# Altium schematic sheet CSP_without_inFET.SchDoc
size A4; DocumentNumber: 2; SheetNumber: 2; SheetTotal: 4
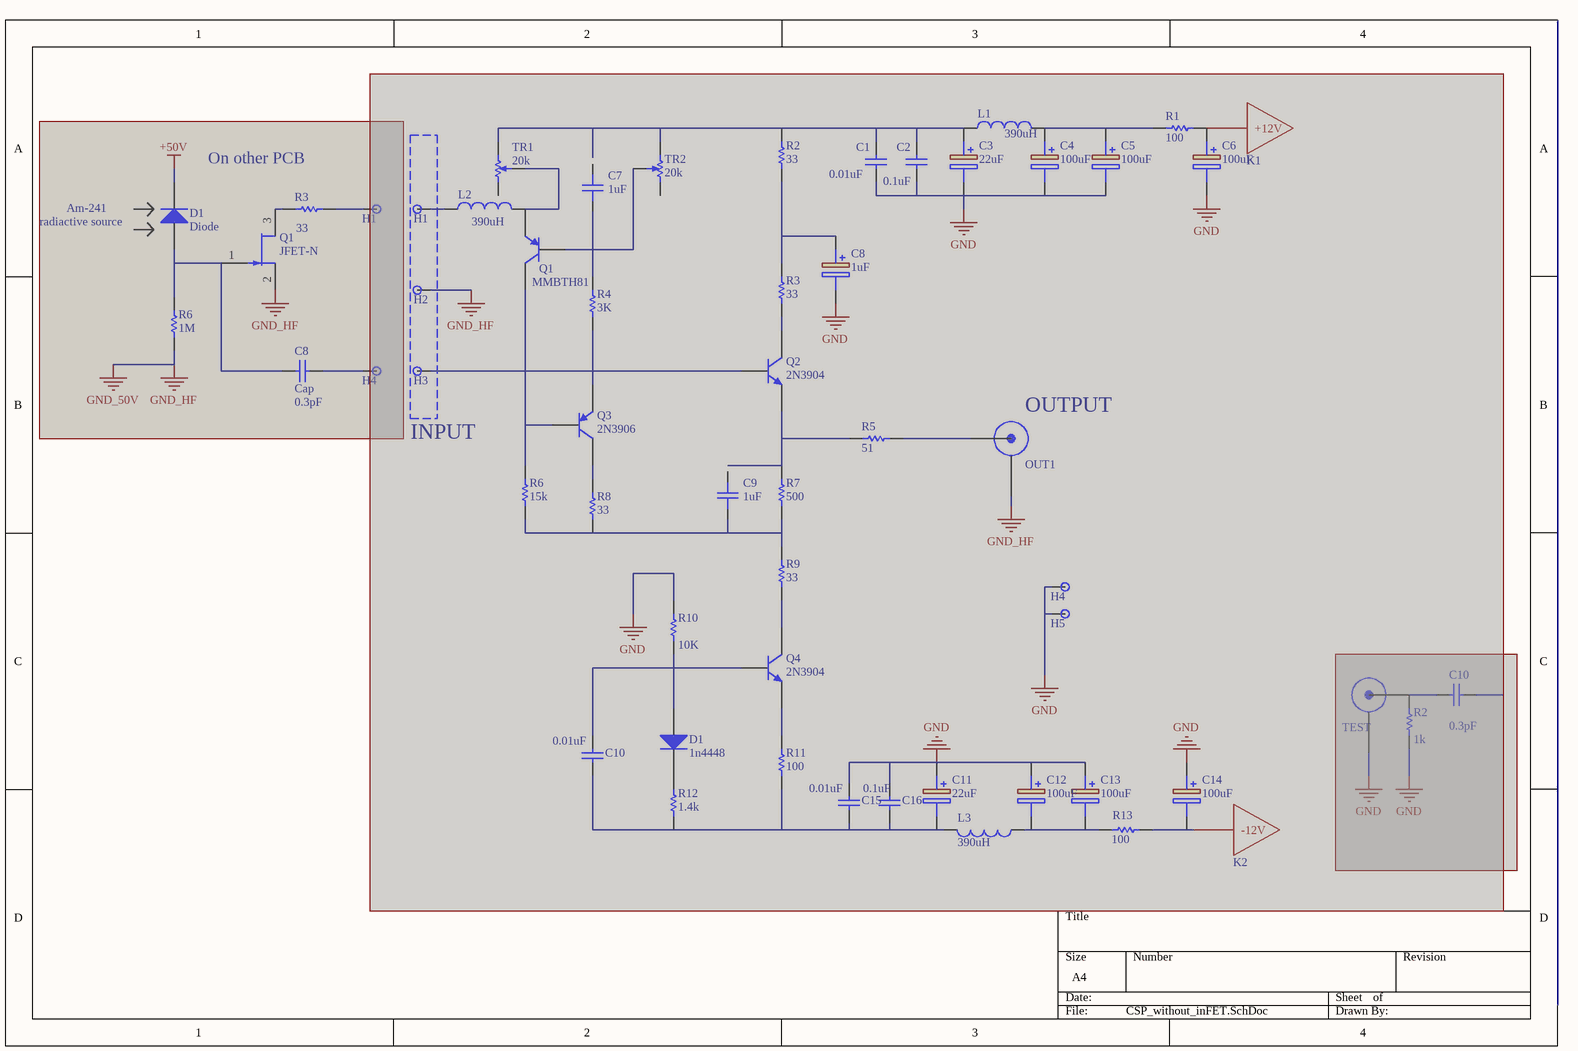
[diagram p0: CSP_without_inFET.SchDoc]

## Parts
(Parts that share a designator on the sheet are numbered #1, #2 ... from top to bottom, then left to right.)
C1  0.01uF  [SMD-0805-C]  (masked out: inside a compile mask, not in the netlist)
C2  0.1uF  [SMD-0805-C]  (masked out: inside a compile mask, not in the netlist)
C3  22uF  [CAPAE660X550N]  (masked out: inside a compile mask, not in the netlist)
C4  100uF  [CAPAE660X800N]  (masked out: inside a compile mask, not in the netlist)
C5  100uF  [CAPAE660X800N]  (masked out: inside a compile mask, not in the netlist)
C6  100uF  [CAPAE660X800N]  (masked out: inside a compile mask, not in the netlist)
C7  1uF  [CAPC3225X15L]  (masked out: inside a compile mask, not in the netlist)
C8#1  1uF  [CAPAE430X550N]  (masked out: inside a compile mask, not in the netlist)
C8#2  Cap  value 0.3pF  [0603]  (masked out: inside a compile mask, not in the netlist)
C9  1uF  [CAPC3225X15L]  (masked out: inside a compile mask, not in the netlist)
C10#1  value 0.3pF  [0603]  (hidden comment: Cap)  (masked out: inside a compile mask, not in the netlist)
C10#2  0.01uF  [SMD-0805-C]  (masked out: inside a compile mask, not in the netlist)
C11  22uF  [CAPAE660X550N]  (masked out: inside a compile mask, not in the netlist)
C12  100uF  [CAPAE660X800N]  (masked out: inside a compile mask, not in the netlist)
C13  100uF  [CAPAE660X800N]  (masked out: inside a compile mask, not in the netlist)
C14  100uF  [CAPAE660X800N]  (masked out: inside a compile mask, not in the netlist)
C15  0.01uF  [SMD-0805-C]  (masked out: inside a compile mask, not in the netlist)
C16  0.1uF  [SMD-0805-C]  (masked out: inside a compile mask, not in the netlist)
D1#1  Diode  [SMC]  (masked out: inside a compile mask, not in the netlist)
D1#2  1n4448  [SODFL350X110-2N]  (masked out: inside a compile mask, not in the netlist)
H1#1  PAD  [PAD]  (value not drawn)  (no BOM)  (masked out: inside a compile mask, not in the netlist)
H1#2  PAD  [PAD]  (value not drawn)  (no BOM)  (masked out: inside a compile mask, not in the netlist)
H2  PAD  [PAD]  (value not drawn)  (no BOM)  (masked out: inside a compile mask, not in the netlist)
H3  PAD  [PAD]  (value not drawn)  (no BOM)  (masked out: inside a compile mask, not in the netlist)
H4#1  PAD  [PAD]  (value not drawn)  (no BOM)  (masked out: inside a compile mask, not in the netlist)
H4#2  PAD  [PAD]  (value not drawn)  (no BOM)  (masked out: inside a compile mask, not in the netlist)
H5  PAD  [PAD]  (value not drawn)  (no BOM)  (masked out: inside a compile mask, not in the netlist)
K1  +12V  [PAD]  (value not drawn)  (no BOM)  (masked out: inside a compile mask, not in the netlist)
K2  -12V  [PAD]  (value not drawn)  (no BOM)  (masked out: inside a compile mask, not in the netlist)
L1  390uH  [INDC3225X270N]  (masked out: inside a compile mask, not in the netlist)
L2  390uH  [INDC3225X270N]  (masked out: inside a compile mask, not in the netlist)
L3  390uH  [INDC3225X270N]  (masked out: inside a compile mask, not in the netlist)
OUT1  OUTPUT  [IN/OUT]  (value not drawn)  (no BOM)  (masked out: inside a compile mask, not in the netlist)
Q1#1  JFET-N  [SOT23_M]  (masked out: inside a compile mask, not in the netlist)
Q1#2  MMBTH81  [SOT23-3P95_240X110L53X44N]  (masked out: inside a compile mask, not in the netlist)
Q2  2N3904  [SOT23-3P95_240X110L53X44N]  (masked out: inside a compile mask, not in the netlist)
Q3  2N3906  [SOT23-3P95_240X110L53X44N]  (masked out: inside a compile mask, not in the netlist)
Q4  2N3904  [SOT23-3P95_240X110L53X44N]  (masked out: inside a compile mask, not in the netlist)
R1  100  [SMD-0805-RES]  (masked out: inside a compile mask, not in the netlist)
R2#1  33  [SMD-0805-RES]  (masked out: inside a compile mask, not in the netlist)
R2#2  value 1k  [SMD-0805-RES]  (hidden comment: Res1)  (masked out: inside a compile mask, not in the netlist)
R3#1  value 33  [SMD-0805-RES]  (masked out: inside a compile mask, not in the netlist)
R3#2  33  [SMD-0805-RES]  (masked out: inside a compile mask, not in the netlist)
R4  3K  [SMD-0805-RES]  (masked out: inside a compile mask, not in the netlist)
R5  51  [SMD-0805-RES]  (masked out: inside a compile mask, not in the netlist)
R6#1  value 1M  [SMD-0805-RES]  (masked out: inside a compile mask, not in the netlist)
R6#2  15k  [SMD-0805-RES]  (masked out: inside a compile mask, not in the netlist)
R7  500  [SMD-0805-RES]  (masked out: inside a compile mask, not in the netlist)
R8  33  [SMD-0805-RES]  (masked out: inside a compile mask, not in the netlist)
R9  33  [SMD-0805-RES]  (masked out: inside a compile mask, not in the netlist)
R10  10K  [SMD-0805-RES]  (masked out: inside a compile mask, not in the netlist)
R11  100  [SMD-0805-RES]  (masked out: inside a compile mask, not in the netlist)
R12  1.4k  [SMD-0805-RES]  (masked out: inside a compile mask, not in the netlist)
R13  100  [SMD-0805-RES]  (masked out: inside a compile mask, not in the netlist)
TEST  INPUT  [IN/OUT]  (value not drawn)  (masked out: inside a compile mask, not in the netlist)
TR1  20k  [POT4MM-2]  (masked out: inside a compile mask, not in the netlist)
TR2  20k  [POT4MM-2]  (masked out: inside a compile mask, not in the netlist)

## Blocks framed on the sheet
On other PCB: C8#2 D1#1 H1#1 H4#1 Q1#1 R3#1 R6#1

## Notes on the sheet
- (near D1#1) radiactive source
- Am-241
- INPUT
- (near OUT1) OUTPUT

## Library data of the parts
C1 C2 C8#2 C10#1 C10#2 C15 C16 = Cap: Capacitor; Published: 8-Jun-2000; LatestRevisionDate: 17-Jul-2002; LatestRevisionNote: Re-released for DXP Platform.; PackageReference: RAD-0.3; Publisher: Altium Limited; PackageDescription: Radial Cap, Thru-Hole; 2 Leads; 0.3 in Pin Spacing
  C1 C10#2 C15: Value: 0.01uF; LCSC Part #: C1710
  C2 C16: Value: 0.1uF; LCSC Part #: C49678
C3 C11 = TYEH1V226F55MTR: 22uF 35V, Capacitor Polarised; Part number: TYEH1V226F55MTR; Value: 22uF; Dimension: 6.3x5.3mm; Voltage: 35V; LCSC Part #: C249771
C4-C6 C12-C14 = EEEFK1E101P: 100uF 25V, cap polarised; Part number: EEEFK1E101P; Dimensions: 8x6.2mm; Voltage: 25V; Value: 100uF; LCSC Part #: C249983
C7 C9 = capacitor: Value: 1uF
C8#1 = UWT1H010MCL1GB: 1uF 50V, Capacitor Polarised; Manufacturer_Name: Nichicon; Part number: UWT1H010MCL1GB; Dimensions: 4x5.4mm; Value: 1uF; Voltage: 50V; LCSC Part #: *
D1#1 = Diode: Default Diode; Published: 8-Jun-2000; LatestRevisionDate: 17-Jul-2002; LatestRevisionNote: Re-released for DXP Platform.; PackageVersion: Sep-1996; PackageReference: SMC; Publisher: Altium Limited; PackageDescription: DO-214-AB/SMC; 2 C-Bend Leads; Body 7.9 x 5.9 mm, inc. leads (LxW); Code_JEDEC: DO-214-AB
D1#2 = Diode: SOD123, 1n4446 orginally; Value: 1n4448; LCSC Part #: C108428
L1-L3 = NLV10JT391: 390uH, Inductor, LCSC part is 330uH1!!!; Resistance: 36; Value: 390uH; Package: 1210; LCSC Part #: C87557
Q1#1 = JFET-N: N-Channel JFET; Published: 8-Jun-2000; LatestRevisionDate: 17-Jul-2002; LatestRevisionNote: Re-released for DXP Platform.; PackageReference: TO-254-AA; Publisher: Altium Limited; Code_JEDEC: TO-254-AA
Q1#2 = PNP: PNP Bipolar Transistor, Aternatives: NTE2403; Published: 8-Jun-2000; LatestRevisionDate: 29-May-2009; LatestRevisionNote: IPC-7351 Footprint Added.; PackageVersion: Aug-1999; PackageReference: SOT-23B; Publisher: Altium Limited; PackageDescription: 3-Pin SOT-23 Package 0.95 mm Pitch, 2.4 mm Lead Span; Supplier 1: Arrow; Supplier Part Number 1: MMBTH81; Supplier 2: Digi-Key; Supplier Part Number 2: KST10MTFCT-ND; Value: MMBTH81; LCSC Part #: C190349
Q2 Q4 = NPN: NPN Bipolar Transistor; Published: 8-Jun-2000; LatestRevisionDate: 17-Jul-2002; LatestRevisionNote: Re-released for DXP Platform.; PackageReference: TO-226-AA; Publisher: Altium Limited; PackageDescription: TO, Flat Index; 3 In-Line, Axial Leads; Body Dia. 4.8mm; Leads 0.55 x 0.51 mm (max); Code_JEDEC: TO-226-AA; Value: 2N3904; LCSC Part #: C18536
Q3 = PNP: PNP Bipolar Transistor; Published: 8-Jun-2000; LatestRevisionDate: 29-May-2009; LatestRevisionNote: IPC-7351 Footprint Added.; PackageVersion: Aug-1999; PackageReference: SOT-23B; Publisher: Altium Limited; PackageDescription: 3-Pin SOT-23 Package 0.95 mm Pitch, 2.4 mm Lead Span; Value: 2N3906; LCSC Part #: C14488
R1 R2#1 R2#2 R3#1 R3#2 R4 R5 R6#1 R6#2 R7-R13 = Res1: Resistor; Published: 8-Jun-2000; LatestRevisionDate: 17-Jul-2002; LatestRevisionNote: Re-released for DXP Platform.; PackageReference: AXIAL-0.3; Publisher: Altium Limited; PackageDescription: Axial Device, Thru-Hole; 2 Leads; 0.3 in Pin Spacing
  R1 R11 R13: Value: 100; LCSC Part #: C17408
  R2#1 R3#2 R8 R9: Value: 33; LCSC Part #: C17634
  R4: Value: 3K; LCSC Part #: C17661
  R5: Value: 51; LCSC Part #: C17738
  R6#2: Value: 15k; LCSC Part #: C17475
  R7: Value: 500; LCSC Part #: C17734
  R10: Value: 10K; LCSC Part #: C17414
  R12: Value: 1.4k; LCSC Part #: C17388
TR1 TR2 = RPot SM: Square Trimming Potentiometer; Published: 17-Dec-2003; DatasheetVersion: Oct-2003; PackageReference: POT4MM-2; Publisher: Altium Limited; PackageDescription: Square Trimming Potentiometer; ComponentLink1Description: Manufacturer Link; ComponentLink1URL: http://bourns.com/2/search.html; Value: 20k; LCSC Part #: *